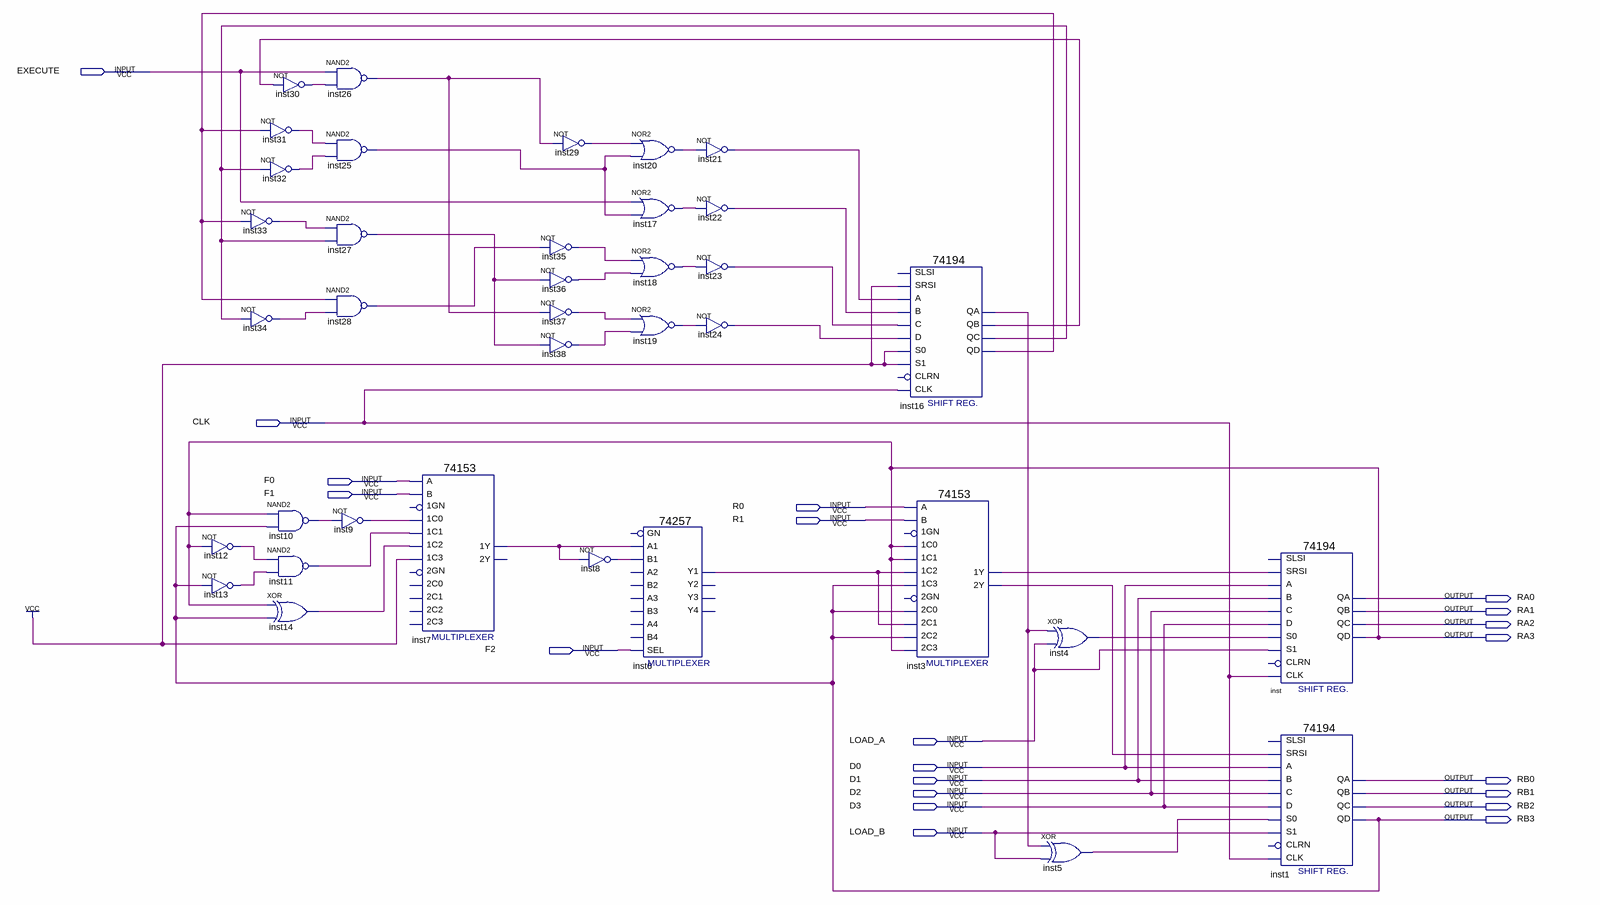
[diagram p0: schematic sheet]
// Quartus schematic lab3.bdf as structural Verilog: 37 symbols, 21 pins
module lab3 (
  input  EXECUTE,
  input  CLK,
  input  F0,
  input  F1,
  input  R0,
  input  R1,
  input  F2,
  input  LOAD_A,
  input  D0,
  input  D1,
  input  D2,
  input  D3,
  input  LOAD_B,
  output RA0,
  output RA1,
  output RA2,
  output RA3,
  output RB0,
  output RB1,
  output RB2,
  output RB3
);

  wire inst3_1y, inst3_2y, inst4_out, inst5_out, inst6_y1, inst7_1y, inst8_out, inst9_out, inst10_out,
       inst11_out, inst12_out, inst13_out, inst14_out, inst16_qa, inst16_qb, inst16_qc, inst16_qd,
       inst17_out, inst18_out, inst19_out, inst20_out, inst21_out, inst22_out, inst23_out, inst24_out,
       inst25_out, inst26_out, inst27_out, inst28_out, inst29_out, inst30_out, inst31_out, inst32_out,
       inst33_out, inst34_out, inst35_out, inst36_out, inst37_out, inst38_out;

  not inst12 (inst12_out, RA3);
  not inst13 (inst13_out, RB3);
  not inst33 (inst33_out, inst16_qd);
  not inst34 (inst34_out, inst16_qc);
  not inst30 (inst30_out, inst16_qb);
  not inst31 (inst31_out, inst16_qd);
  not inst32 (inst32_out, inst16_qc);
  nand inst10 (inst10_out, RA3, RB3);
  nand inst11 (inst11_out, inst12_out, inst13_out);
  xor inst14 (inst14_out, RA3, RB3);
  nand inst26 (inst26_out, EXECUTE, inst30_out);
  nand inst25 (inst25_out, inst31_out, inst32_out);
  nand inst27 (inst27_out, inst33_out, inst16_qc);
  nand inst28 (inst28_out, inst16_qd, inst34_out);
  not inst9 (inst9_out, inst10_out);
  \74153  inst7 (
    .\1C1 (inst11_out), .\1C0 (inst9_out), .\1C2 (inst14_out), .\1C3 (1'b1), .B(F1), .A(F0), .\1Y (inst7_1y));  // open: 1GN, 2C0, 2GN, 2C2, 2C1, 2C3, 2Y
  not inst29 (inst29_out, inst26_out);
  not inst35 (inst35_out, inst28_out);
  not inst36 (inst36_out, inst27_out);
  not inst37 (inst37_out, inst26_out);
  not inst38 (inst38_out, inst27_out);
  not inst8 (inst8_out, inst7_1y);
  nor inst20 (inst20_out, inst29_out, inst25_out);
  nor inst17 (inst17_out, EXECUTE, inst25_out);
  nor inst18 (inst18_out, inst35_out, inst36_out);
  nor inst19 (inst19_out, inst37_out, inst38_out);
  \74257  inst6 (
    .B1(inst8_out), .A1(inst7_1y), .SEL(F2), .Y1(inst6_y1));  // open: B3, A2, B2, A3, A4, B4, GN, Y2, Y3, Y4
  not inst21 (inst21_out, inst20_out);
  not inst22 (inst22_out, inst17_out);
  not inst23 (inst23_out, inst18_out);
  not inst24 (inst24_out, inst19_out);
  \74194  inst16 (
    .SRSI(1'b1), .B(inst22_out), .C(inst23_out), .CLK(CLK), .D(inst24_out), .S1(1'b1), .S0(1'b1),
    .A(inst21_out), .QA(inst16_qa), .QB(inst16_qb), .QC(inst16_qc), .QD(inst16_qd));  // open: SLSI, CLRN
  \74153  inst3 (
    .\1C1 (RA3), .\1C0 (RA3), .\2C0 (RB3), .\2C2 (RB3), .\1C2 (inst6_y1), .\1C3 (RB3), .B(R1), .A(R0),
    .\2C1 (inst6_y1), .\2C3 (RA3), .\1Y (inst3_1y), .\2Y (inst3_2y));  // open: 1GN, 2GN
  xor inst4 (inst4_out, inst16_qa, LOAD_A);
  xor inst5 (inst5_out, inst16_qa, LOAD_B);
  \74194  inst (
    .SRSI(inst3_1y), .B(D1), .C(D2), .CLK(CLK), .D(D3), .S1(LOAD_A), .S0(inst4_out), .A(D0), .QA(RA0),
    .QB(RA1), .QC(RA2), .QD(RA3));  // open: SLSI, CLRN
  \74194  inst1 (
    .SRSI(inst3_2y), .B(D1), .C(D2), .CLK(CLK), .D(D3), .S1(LOAD_B), .S0(inst5_out), .A(D0), .QA(RB0),
    .QB(RB1), .QC(RB2), .QD(RB3));  // open: SLSI, CLRN
endmodule
